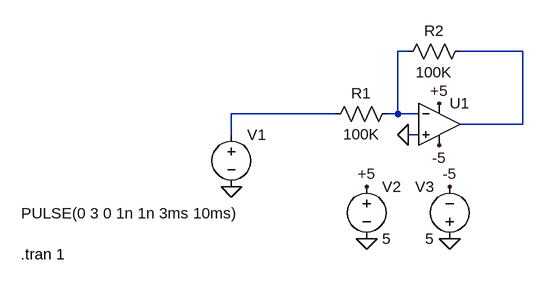
[diagram p0: schematic Draft4.asc]
Draft4.asc, the LTspice schematic file:
Version 4
SHEET 1 880 680
WIRE -256 -16 -272 -16
WIRE -80 -16 -176 -16
WIRE -368 80 -528 80
WIRE -272 80 -272 -16
WIRE -272 80 -288 80
WIRE -240 80 -272 80
WIRE -80 96 -80 -16
WIRE -80 96 -176 96
WIRE -528 112 -528 80
WIRE -240 112 -256 112
FLAG -208 64 +5
FLAG -208 128 -5
FLAG -320 272 0
FLAG -192 272 0
FLAG -192 192 -5
FLAG -320 192 +5
FLAG -256 112 0
FLAG -528 192 0
SYMBOL Opamps\\UniversalOpamp2 -208 96 R0
SYMATTR InstName U1
SYMBOL voltage -320 176 R0
WINDOW 123 0 0 Left 2
WINDOW 39 0 0 Left 2
SYMATTR InstName V2
SYMATTR Value 5
SYMBOL voltage -192 288 R180
WINDOW 0 24 96 Left 2
WINDOW 3 24 16 Left 2
WINDOW 123 0 0 Left 2
WINDOW 39 0 0 Left 2
SYMATTR InstName V3
SYMATTR Value 5
SYMBOL res -272 64 R90
WINDOW 0 0 56 VBottom 2
WINDOW 3 32 56 VTop 2
SYMATTR InstName R1
SYMATTR Value 100K
SYMBOL res -160 -32 R90
WINDOW 0 0 56 VBottom 2
WINDOW 3 32 56 VTop 2
SYMATTR InstName R2
SYMATTR Value 100K
SYMBOL voltage -528 96 R0
WINDOW 123 0 0 Left 2
WINDOW 39 0 0 Left 2
WINDOW 3 -323 137 Left 2
SYMATTR InstName V1
SYMATTR Value PULSE(0 3 0 1n 1n 3ms 10ms)
TEXT -852 296 Left 2 !.tran 1

The netlist it stands for:
* Draft4.asc
XU1 0 N001 +5 -5 N002 level.2 Avol=1Meg GBW=10Meg Slew=10Meg ilimit=25m rail=0 Vos=0 phimargin=45 en=0 enk=0 in=0 ink=0 Rin=500Meg  ; pins IN+ IN- V+ V- OUT
V2 +5 0 5
V3 0 -5 5
R1 N001 N003 100K
R2 N002 N001 100K
V1 N003 0 PULSE(0 3 0 1n 1n 3ms 10ms)
.tran 1
.lib UniversalOpamps2.sub
.backanno
.end